# Altium schematic sheet amplis.SchDoc
size A3
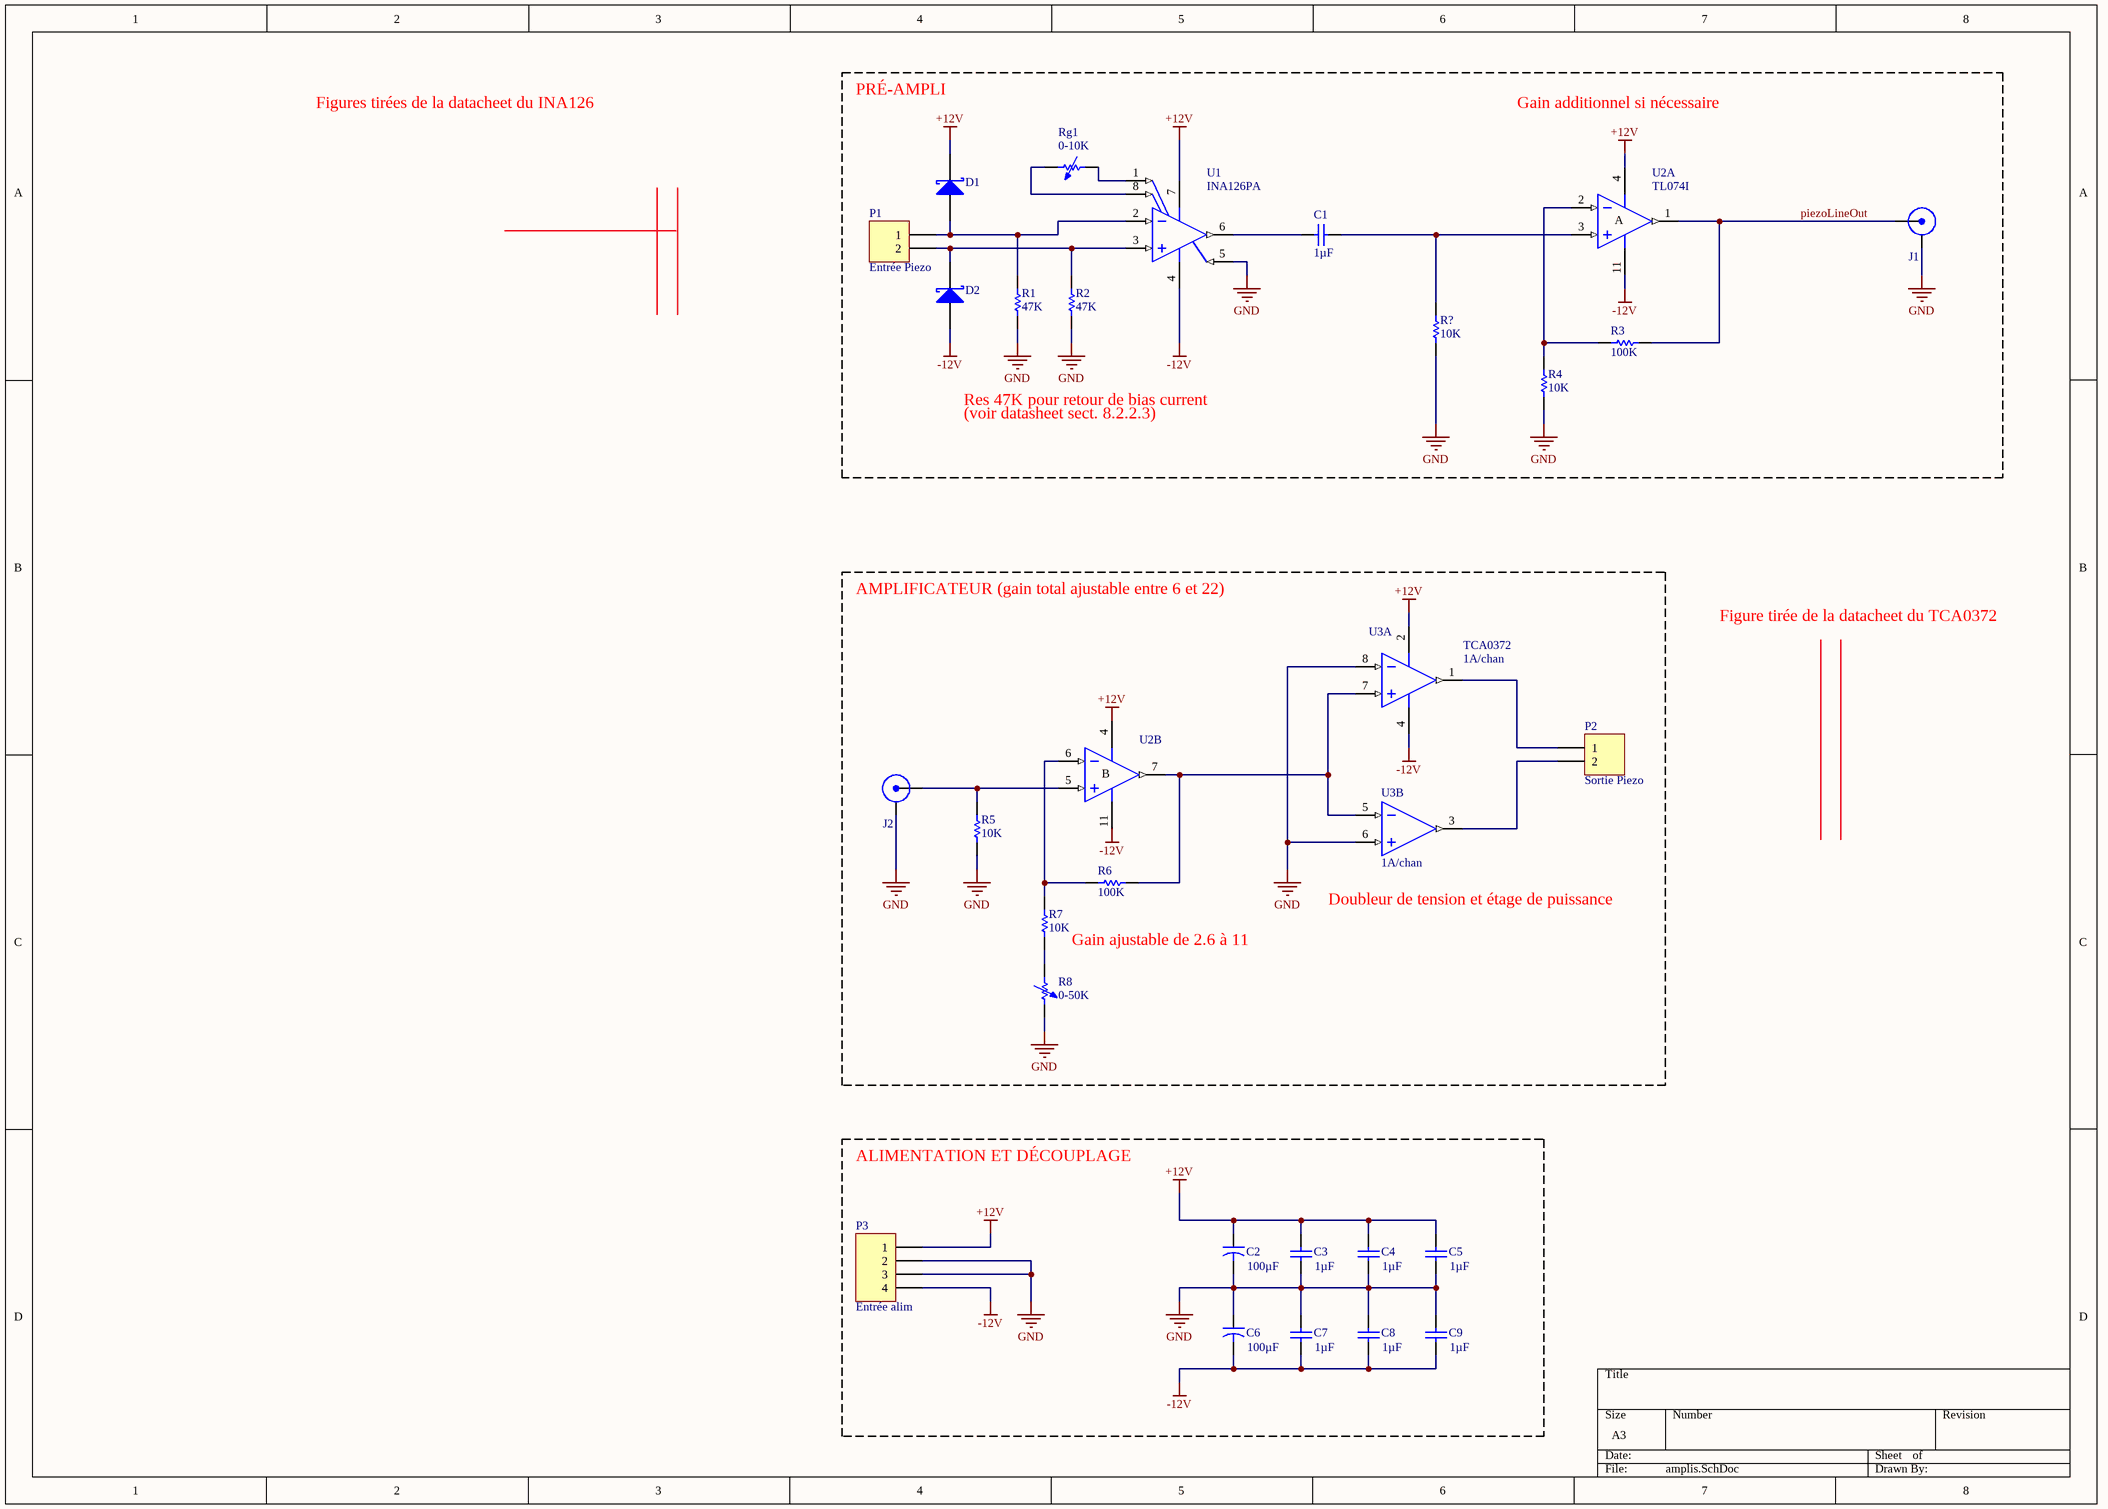
[diagram p0: amplis.SchDoc]

## Parts
C1  value 1µF  [RAD-0.3]  (hidden comment: Cap)
C2  value 100µF  [CAPR5-4X5]  (hidden comment: Cap2)
C3  value 1µF  [RAD-0.3]  (hidden comment: Cap)
C4  value 1µF  [RAD-0.3]  (hidden comment: Cap)
C5  value 1µF  [RAD-0.3]  (hidden comment: Cap)
C6  value 100µF  [CAPR5-4X5]  (hidden comment: Cap2)
C7  value 1µF  [RAD-0.3]  (hidden comment: Cap)
C8  value 1µF  [RAD-0.3]  (hidden comment: Cap)
C9  value 1µF  [RAD-0.3]  (hidden comment: Cap)
D1  D Schottky  [SMB]  (value not drawn)
D2  D Schottky  [SMB]  (value not drawn)
J1  BNC  [BNC_Vertical]  (value not drawn)
J2  BNC  [BNC_Vertical]  (value not drawn)
P1  Entrée Piezo  [HDR1X2]
P2  Sortie Piezo  [HDR1X2]
P3  Entrée alim  [HDR1X4]
R1  value 47K  [AXIAL-0.3]  (hidden comment: Res1)
R2  value 47K  [AXIAL-0.3]  (hidden comment: Res1)
R3  value 100K  [AXIAL-0.3]  (hidden comment: Res1)
R4  value 10K  [AXIAL-0.3]  (hidden comment: Res1)
R5  value 10K  [AXIAL-0.3]  (hidden comment: Res1)
R6  value 100K  [AXIAL-0.3]  (hidden comment: Res1)
R7  value 10K  [AXIAL-0.3]  (hidden comment: Res1)
R8  value 0-50K  [AXIAL-0.7]  (hidden comment: Res Adj1)
R?  value 10K  [AXIAL-0.3]  (hidden comment: Res1)
Rg1  value 0-10K  [AXIAL-0.7]  (hidden comment: Res Adj1)
U1  INA126PA  [TI-P8]
U2  TL074I  [SOIC-14]  (parts A,B of 4)
U3  1A/chan  model: TCA0372  (parts A,B of 2)

## Blocks framed on the sheet
ALIMENTATION ET DÉCOUPLAGE: C2-C9 P3

## Nets
+12V: C2.1 C3.2 C4.2 C5.2 D1.2(K) P3.1 U1.7(V+) U2.4(V+) U3.2(V+)
-12V: C6.2 C7.1 C8.1 C9.1 D2.1(A) P3.4 U1.4(V-) U2.11(V-) U3.4(V-)
GND: C2.2 C3.1 C4.1 C5.1 C6.1 C7.2 C8.2 C9.2 J1.2(Gnd) J2.2(Gnd) P3.2 P3.3 R1.1 R2.1 R4.2 R5.2 R8.2 R?.2 U1.5(REF) U3.6(VIN+) U3.8(VIN-)
piezoLineOut: J1.1(Sig) R3.1 U2.1(OUT)
NetC1_1: C1.1 R?.1 U2.3(IN+)
NetC1_2: C1.2 U1.6(VO)
NetD1_1: D1.1(A) P1.1 R1.2 U1.2(VIN-)
NetD2_2: D2.2(K) P1.2 R2.2 U1.3(VIN+)
NetJ2_1: J2.1(Sig) R5.1 U2.5(IN+)
NetP2_1: P2.1 U3.1(VOUT)
NetP2_2: P2.2 U3.3(VOUT)
NetR3_2: R3.2 R4.1 U2.2(IN-)
NetR6_1: R6.1 U2.7(OUT) U3.5(VIN-) U3.7(VIN+)
NetR6_2: R6.2 R7.1 U2.6(IN-)
NetR7_2: R7.2 R8.1
NetRg1_1: Rg1.1 U1.1(RG)
NetRg1_2: Rg1.2 U1.8(RG)

## Notes on the sheet
- Figures tirées de la datacheet du INA126
- PRÉ-AMPLI
- Gain additionnel si nécessaire
- Res 47K pour retour de bias current
- (voir datasheet sect. 8.2.2.3)
- AMPLIFICATEUR (gain total ajustable entre 6 et 22)
- Figure tirée de la datacheet du TCA0372
- (near U3) Doubleur de tension et étage de puissance
- Gain ajustable de 2.6 à 11
- (in symbol TL074I, part A) A
- (in symbol TL074I, part B) B

## Library data of the parts
C1 C3-C5 C7-C9 = Cap: Capacitor; Published: 8-Jun-2000; LatestRevisionDate: 17-Jul-2002; LatestRevisionNote: Re-released for DXP Platform.; PackageReference: RAD-0.3; Publisher: Altium Limited; PackageDescription: Radial Cap, Thru-Hole; 2 Leads; 0.3 in Pin Spacing
C2 C6 = Cap2: Capacitor; Published: 23-Sep-2002; PackageReference: CAPR5-4X5; Publisher: Altium Limited; PackageDescription: Capacitor; 2 Leads
D1 D2 = D Schottky: Schottky Diode; Published: 8-Jun-2000; LatestRevisionDate: 17-Jul-2002; LatestRevisionNote: Re-released for DXP Platform.; PackageReference: SMB; Publisher: Altium Limited; PackageDescription: DO-214-AA/SMB; 2 C-Bend Leads; Body 5.3 x 3.6 mm, inc. leads (LxW); Code_JEDEC: DO-214-AA
P1 P2 = Header 2: Header, 2-Pin; LatestRevisionDate: 17-Jul-2002; LatestRevisionNote: Re-released for DXP Platform.; Publisher: Altium Limited
P3 = Header 4: Header, 4-Pin; LatestRevisionDate: 17-Jul-2002; LatestRevisionNote: Re-released for DXP Platform.; Publisher: Altium Limited
R1-R7 R? = Res1: Resistor; Published: 8-Jun-2000; LatestRevisionDate: 17-Jul-2002; LatestRevisionNote: Re-released for DXP Platform.; PackageReference: AXIAL-0.3; Publisher: Altium Limited; PackageDescription: Axial Device, Thru-Hole; 2 Leads; 0.3 in Pin Spacing
R8 Rg1 = Res Adj1: Variable Resistor; Set Position: 0.5; Published: 8-Jun-2000; LatestRevisionDate: 17-Jul-2002; LatestRevisionNote: Re-released for DXP Platform.; PackageReference: AXIAL-0.7; Publisher: Altium Limited; PackageDescription: Axial Device, Thru-Hole; 2 Leads; 0.7 in Pin Spacing
U1 = INA126PA: Micropower Instrumentation Amplifier Single and Dual Versions, -40 to 85 degC, 8-pin DIP (P8), Green (RoHS & no Sb/Br); Manufacturer: Texas Instruments; CMRR(Min)(dB): 74; Gain(V/V): 5 to 10000; Input Bias Current (+/-)(Max)(nA): 50; Input Offset (+/-)(Max)(uV): 500; Input Offset Drift (+/-)(Max)(uV/Degrees Celsius): 5; Noise at 1kHz(Typ)(nV/rt(Hz)): 35; Non-Linearity (+/-)(Max)(%): 0.012; Number of Channels: 1; Quiescent Current (+/-)(Typ)(mA): 0.175; SubFamily: Dual Supply; Vs(Max)(V): 36; Vs(Min)(V): 2.7; DatasheetVersion: SBOS062A; PackageVersion: 4040082/E, 04/2010; PackageReference: P8; PackageDescription: 8-Pin Plastic In-Line, Body 9.59 x 6.35 mm, Pitch 2.54 mm; Supplier 1: Digi-Key; Supplier Part Number 1: INA126PA-ND; Supplier 2: Farnell; Supplier Part Number 2: 1417402; Supplier 3: Newark; Supplier Part Number 3: 96K4516; Supplier 4: Mouser; Supplier Part Number 4: 595-INA126PA; Eco-Plan: Green (RoHS & no Sb/Br); Mounting Technology: Through Hole; Code_JEDEC: MS-001; PartNumber: INA126PA; ComponentLink1Description: Manufacturer URL; ComponentLink1URL: http://www.ti.com/; ComponentLink2Description: Datasheet; ComponentLink2URL: http://www.ti.com/general/docs/lit/getliterature.tsp?genericPartNumber=INA126&fileType=pdf; ComponentLink3Description: Package Specification; ComponentLink3URL: http://www.ti.com/litv/pdf/mpdi001b
U2 = TL074I: Low-Noise J-FET Quad Operational Amplifier; Published: 24-Aug-2001; LatestRevisionDate: 13-Apr-2006; LatestRevisionNote: IPC-7351 Footprint Added.; DatasheetVersion: Dec-1998; PackageVersion: Sep-1998; PackageReference: SOIC-14; Publisher: Altium Limited; PackageDescription: 14-Pin Small Outline Integrated Circuit 1.27 mm Pitch; Code_IPC: SOIC127P600-14; ComponentLink1Description: Manufacturer Link; ComponentLink1URL: http://www.st.com/; ComponentLink2Description: Datasheet; ComponentLink2URL: http://www.st.com/stonline/products/literature/ds/2297/tl074.pdf
U3 = TCA0372_case626